# EAGLE schematic main (EAGLE 7.4.0)
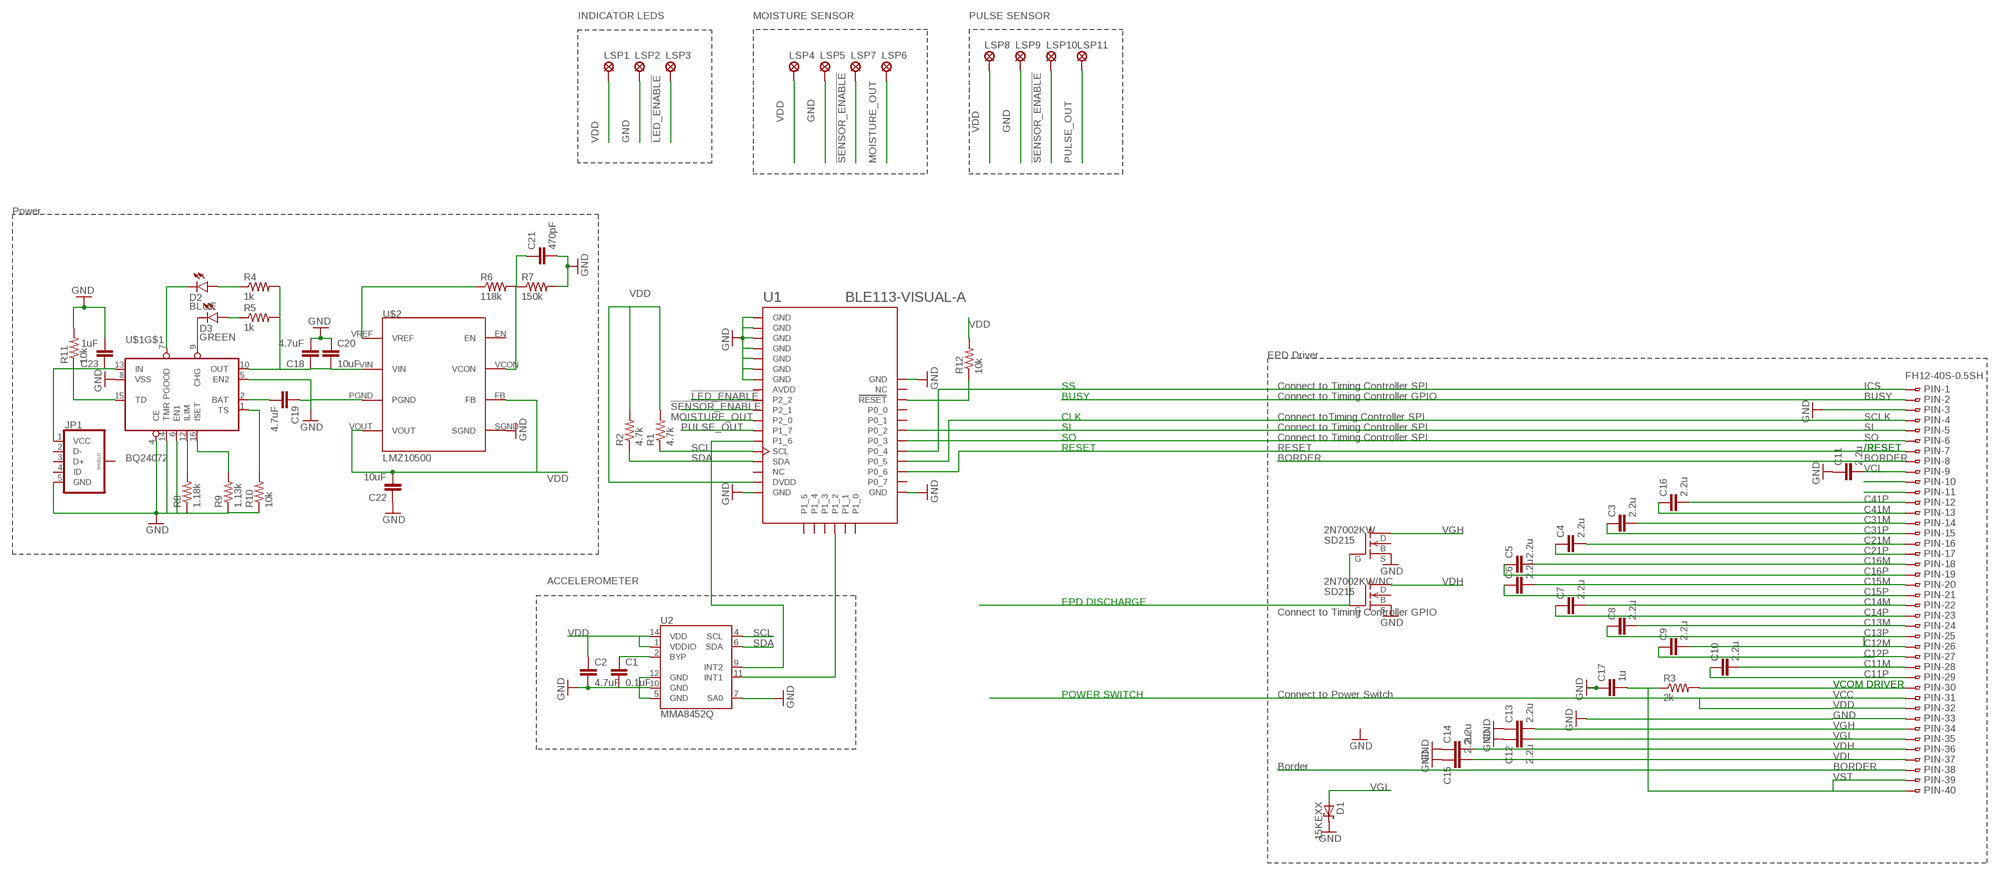
[diagram p0: schematic, sheet 1]

## Parts
2N7002KW  SD215  [TO72]
2N7002KW/NC  SD215  [TO72]
C1  0.1uF  CAP0603-CAP  [0603-CAP]
C2  4.7uF  CAP0603-CAP  [0603-CAP]
C3  2.2u  CAP0603-CAP  [0603-CAP]
C4  2.2u  CAP0603-CAP  [0603-CAP]
C5  2.2u  CAP0603-CAP  [0603-CAP]
C6  2.2u  CAP0603-CAP  [0603-CAP]
C7  2.2u  CAP0603-CAP  [0603-CAP]
C8  2.2u  CAP0603-CAP  [0603-CAP]
C9  2.2u  CAP0603-CAP  [0603-CAP]
C10  2.2u  CAP0603-CAP  [0603-CAP]
C11  2.2u  CAP0603-CAP  [0603-CAP]
C12  2.2u  CAP0603-CAP  [0603-CAP]
C13  2.2u  CAP0603-CAP  [0603-CAP]
C14  2.2u  CAP0603-CAP  [0603-CAP]
C15  2.2u  CAP0603-CAP  [0603-CAP]
C16  2.2u  CAP0603-CAP  [0603-CAP]
C17  1u  CAP0603-CAP  [0603-CAP]
C18  4.7uF  CAP0603-CAP  [0603-CAP]
C19  4.7uF  CAP0603-CAP  [0603-CAP]
C20  10uF  CAP0603-CAP  [0603-CAP]
C21  470pF  CAP0603-CAP  [0603-CAP]
C22  10uF  CAP0603-CAP  [0603-CAP]
C23  1uF  CAP0603-CAP  [0603-CAP]
D1  15KEXX  [CB429-17]
D2  BLUE  LED-BLUE0603  [LED-0603]
D3  GREEN  LED-GREEN0603  [LED-0603]
JP1  USB_MICROB_PLUG-SMT  [MICRO-B-SMT]
LSP1  LSP10  [LSP10]
LSP2  LSP10  [LSP10]
LSP3  LSP10  [LSP10]
LSP4  LSP10  [LSP10]
LSP5  LSP10  [LSP10]
LSP6  LSP10  [LSP10]
LSP7  LSP10  [LSP10]
LSP8  LSP10  [LSP10]
LSP9  LSP10  [LSP10]
LSP10  LSP10  [LSP10]
LSP11  LSP10  [LSP10]
PIN  FH12-40S-0.5SH  [FH12-40S-0.5SH]
R1  4.7k  RESISTOR0603-RES  [0603-RES]
R2  4.7k  RESISTOR0603-RES  [0603-RES]
R3  2k  RESISTOR0402-RES  [0402-RES]
R4  1k  RESISTOR0603-RES  [0603-RES]
R5  1k  RESISTOR0603-RES  [0603-RES]
R6  118k  RESISTOR0603-RES  [0603-RES]
R7  150k  RESISTOR0603-RES  [0603-RES]
R8  1.18k  RESISTOR0603-RES  [0603-RES]
R9  1.13k  RESISTOR0603-RES  [0603-RES]
R10  10k  RESISTOR0603-RES  [0603-RES]
R11  10k  RESISTOR0603-RES  [0603-RES]
R12  10k  RESISTOR0603  [0603-RES]
U1  BLE113-VISUAL-A  [BLE113-A]
U2  MMA8452Q  [QFN-16_0.5MM]
U$1  BQ24072  [S-PVQFN-N16]
U$2  LMZ10500  [LMZ10500]

## Nets
!LED_ENABLE: LSP3.MP U1.P2_2
!SENSOR_ENABLE: LSP7.MP LSP10.MP U1.P2_1
GND: 2N7002KW.1(S) 2N7002KW/NC.1(S) C1.2 C2.2 C11.1 C12.1 C13.1 C14.1 C15.1 C17.1 C18.2 C19.1 C20.1 C21.2 C22.1 C23.2 D1.C JP1.5(GND) LSP2.MP LSP5.MP LSP9.MP PIN.3 R7.2 R8.1 R9.1 R10.1 R11.2 U1.GND U1.GND@2(GND) U1.GND@3(GND) U1.GND@4(GND) U1.GND@5(GND) U1.GND@6(GND) U1.GND@7(GND) U1.GND@8(GND) U1.GND@9(GND) U1.GND@10(GND) U2.5(GND) U2.7(SA0) U2.10(GND) U2.12(GND) U$1.4(CE) U$1.5(EN2) U$1.6(EN1) U$1.8(VSS) U$1.14(TMR) U$2.PGND U$2.SGND
MOISTURE_OUT: LSP6.MP U1.P2_0
N$1: PIN.4 U1.P0_5
N$2: PIN.2
N$3: U1.P1_6 U2.9(INT2)
N$4: U1.P1_2 U2.11(INT1)
N$5: PIN.5 U1.P0_2
N$6: PIN.6 U1.P0_3
N$7: C1.1 U2.2(BYP)
N$8: PIN.7 U1.P0_6
N$9: C11.2 PIN.9
N$10: PIN.10
N$11: PIN.11
N$12: C16.2 PIN.12
N$13: C16.1 PIN.13
N$14: C3.2 PIN.14
N$15: C3.1 PIN.15
N$16: C4.2 PIN.16
N$17: C4.1 PIN.17
N$18: C5.2 PIN.18
N$19: C5.1 PIN.19
N$20: C6.2 PIN.20
N$21: C6.1 PIN.21
N$22: C7.2 PIN.22
N$23: C7.1 PIN.23
N$24: C8.2 PIN.24
N$25: C8.1 C9.2 PIN.25
N$26: PIN.26
N$27: PIN.27
N$28: C10.2 PIN.28
N$29: C10.1 PIN.29
N$30: PIN.30 R3.2
N$31: PIN.31
N$32: PIN.32
N$33: PIN.33
N$34: C12.2 PIN.34
N$35: C13.2 PIN.35
N$36: C14.2 PIN.36
N$37: PIN.38
N$38: C15.2 PIN.37
N$39: PIN.8
N$40: C17.2 PIN.39 PIN.40 R3.1
N$41: 2N7002KW/NC.2(D)
N$42: 2N7002KW.2(D)
N$43: 2N7002KW.3(G) 2N7002KW/NC.3(G)
N$44: D1.A
N$46: PIN.1 U1.P0_4
N$47: C9.1
N$48: C23.1 JP1.1(VCC) R11.1 U$1.13(IN) U$1.15(TD)
N$49: R12.1 U1.RESET
N$50: D3.A R5.1
N$51: D3.C U$1.9(CHG)
N$52: D2.C U$1.7(PGOOD)
N$53: D2.A R4.1
N$54: R8.2 U$1.12(ILIM)
N$55: R9.2 U$1.16(ISET)
N$56: R10.2 U$1.1(TS)
N$58: R6.1 U$2.VREF
N$59: C18.1 C20.2 R4.2 R5.2 U$1.10(OUT) U$2.VIN
N$60: C19.2 U$1.2(BAT)
N$62: C21.1 R6.2 R7.1 U$2.VCON
PULSE_OUT: LSP11.MP U1.P1_7
SCL: R1.1 U1.SCL U2.4(SCL)
SDA: R2.1 U1.SDA U2.6(SDA)
VDD: C2.1 C22.2 LSP1.MP LSP4.MP LSP8.MP R1.2 R2.2 R12.2 U1.DVDD U2.1(VDDIO) U2.14(VDD) U$2.FB U$2.VOUT
Unconnected: 2N7002KW.4(B) 2N7002KW/NC.4(B) JP1.2(D-) JP1.3(D+) JP1.4(ID) JP1.P$6(SHIELD) U1.NC U1.NC@2(NC) U1.P0_0 U1.P0_1 U1.P0_7 U1.P1_0 U1.P1_1 U1.P1_3 U1.P1_4 U1.P1_5 U$1.TH(TH:TH) U$2.EN

## Notes on the sheet
- INDICATOR LEDS | MOISTURE SENSOR | PULSE SENSOR
- Power
- EPD Driver
- SS | Connect to Timing Controller SPI | ICS
- BUSY | Connect to Timing Controller GPIO | BUSY
- CLK | Connect toTiming Controller SPI | SCLK
- SI | Connect to Timing Controller SPI | SI
- SO | Connect to Timing Controller SPI | SO
- RESET | RESET | /RESET | /RESET
- BORDER | BORDER
- VCL
- C41P
- C41M
- C31M
- VGH | C31P
- C21M
- C21P
- C16M
- C16P
- VDH | C15M
- ACCELEROMETER | C15P
- EPD DISCHARGE | C14M
- Connect to Timing Controller GPIO | C14P
- C13M
- C13P
- C12M
- C12P
- C11M
- C11P
- VCOM DRIVER | VCOM DRIVER
- POWER SWITCH | Connect to Power Switch | VCC
- VDD
- GND
- VGH
- VGL
- VDH
- VDL
- Border | BORDER
- VST
- VGL

## Power pins joined to a net without a drawn wire
AVDD: U1.AVDD

## Library data of the parts
2N7002KW 2N7002KW/NC = transistor-fet:SD215: N-Channel Enhancement MOSFET
C1-C17 = SparkFun-Capacitors:CAP: Capacitor Standard 0603 ceramic capacitor, and 0.1" leaded capacitor.
C18-C23 = SparkFun-Passives:CAP: Capacitor Standard 0603 ceramic capacitor, and 0.1" leaded capacitor.
D1 = diode:15KEXX: DIODE
D2 = SparkFun-LED:LED-BLUE: Blue LEDs for production use Various blue LEDs stocked by SparkFun production 0603 - DIO-08575 Rebel - DIO-09553 1206 - DIO-09911; PROD_ID: DIO-08575
D3 = SparkFun-LED:LED-GREEN: Various green LEDs Green LEDs used in SFE Production 0603- DIO-00821 LARGE- DIO-00862 LILYPAD- DIO-09910; PROD_ID: DIO-00821
JP1 = SparkFun-Connectors:USB_MICROB_PLUG: USB Micro-B connectors Some male, some female. Watch your step!; PROD_ID: CONN-09900
LSP1-LSP11 = solpad:LSP10: SOLDER PAD drill 1.0 mm, distributor Buerklin, 12H555
PIN = con-hirose:FH12-40S-0.5S: 0.5mm Pitch Connectors For FPC/FFC Source: Data sheet <http://www.hirose.co.jp/cataloge_hp/e58605370.pdf>; MPN: FH12-40S-0.5SH(55); OC_FARNELL: 1324556; OC_NEWARK: 34M6178
R1-R11 = SparkFun-Passives:RESISTOR: Resistor Basic schematic elements and footprints for 0603, 1206, and PTH resistors.
R12 = SparkFun-Resistors:RESISTOR: Resistor Basic schematic elements and footprints for 0603, 1206, and PTH resistors.
U1 = sf-bluegiga:BLE113-VISUAL: Bluetooth Low Energy single-mode module - Bluetooth 4.0 (CC2541). BLE113-A variant has an on-module ceramic chip antenna. BLE113-A variant includes keepout/restrict area. Antenna edge of the module should be flush up against the edge of the PCB. See datasheet for variant layout details. The BLE113 is a Bluetooth Smart module targeted for small and low-power sensors and accessories. It integrates all features required for a Bluetooth Smart application, including Bluetooth radio, software stack, and GATT-based profiles. The BLE113 Bluetooth Smart module can also host end-user applications, which means no external micro controller is required in size or price constrained devices. Moreover, it has flexible hardware interfaces to connect to different peripherals and sensors and can be powered directly from a standard 3V coin cell battery or a pair of AAA batteries. In the lowest power sleep mode it merely consumes 500 nA and will wake up within a few hundred microseconds. The BLE113 Bluetooth Smart module conusmer approximately 30% less power and is smaller than the BLE112 Bluetooth Smart Module. http://www.bluegiga.com/en-US/products/bluetooth-4.0-modules/ble113-bluetooth--smart-module https://github.com/jrowberg/sf-oshw Last updated 2014-01-04 by Jeff Rowberg <jeff@rowberg.net>; ANTENNA: On-module ceramic chip antenna
U2 = SparkFun-Sensors:MMA8452Q: MMA8452Q 3-Axis, 12/8-bit Digital Accelerometer Supply Voltage: 1.6-3.6V Range: +/- 2g, 4g, 8g Interface: I2C, 12-bit and 8-bit ODR: 1.56 Hz - 800 Hz Package: QFN-16 http://cache.freescale.com/files/sensors/doc/data_sheet/MMA8452Q.pdf; PROD_ID: IC-10769
U$1 = Simplex-ICs:BQ24072: TI BQ24072 - Li battery charger and power path management ic
U$2 = LMZ10500:LMZ10500